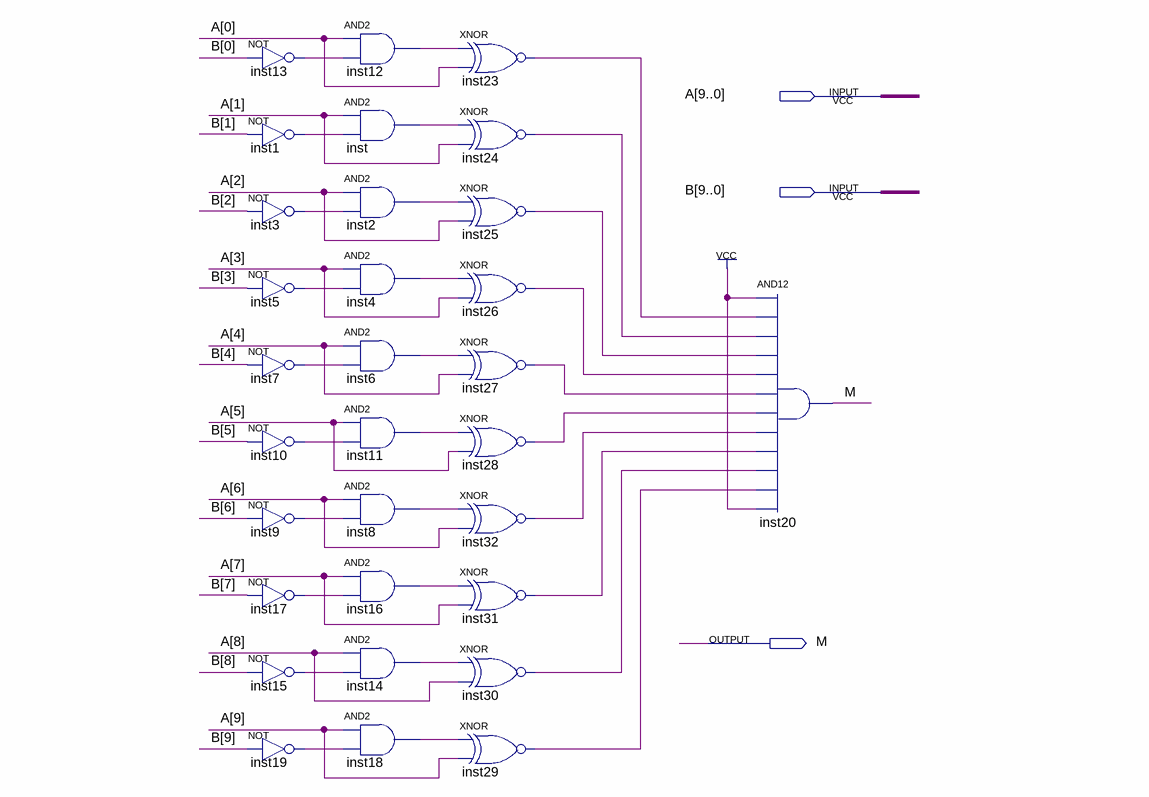
[diagram p0: schematic sheet]
// Quartus schematic Maior_10b.bdf as structural Verilog: 31 symbols, 3 pins
module Maior_10b (
  input  [9:0] A,
  input  [9:0] B,
  output M
);

  wire inst1_out, inst2_out, inst3_out, inst4_out, inst5_out, inst6_out, inst7_out, inst8_out, inst9_out,
       inst10_out, inst11_out, inst12_out, inst13_out, inst14_out, inst15_out, inst16_out, inst17_out,
       inst18_out, inst19_out, inst24_out, inst28_out, inst30_out, inst_out;

  not inst13 (inst13_out, B[0]);
  not inst1 (inst1_out, B[1]);
  not inst3 (inst3_out, B[2]);
  not inst5 (inst5_out, B[3]);
  not inst7 (inst7_out, B[4]);
  not inst10 (inst10_out, B[5]);
  not inst9 (inst9_out, B[6]);
  not inst17 (inst17_out, B[7]);
  not inst15 (inst15_out, B[8]);
  not inst19 (inst19_out, B[9]);
  and inst12 (inst12_out, A[0], inst13_out);
  and inst (inst_out, A[1], inst1_out);
  and inst2 (inst2_out, A[2], inst3_out);
  and inst4 (inst4_out, A[3], inst5_out);
  and inst6 (inst6_out, A[4], inst7_out);
  and inst11 (inst11_out, A[5], inst10_out);
  and inst8 (inst8_out, A[6], inst9_out);
  and inst16 (inst16_out, A[7], inst17_out);
  and inst14 (inst14_out, A[8], inst15_out);
  and inst18 (inst18_out, A[9], inst19_out);
  xnor inst23 (inst12_out, inst12_out, A[0]);
  xnor inst24 (inst24_out, inst_out, A[1]);
  xnor inst25 (inst2_out, inst2_out, A[2]);
  xnor inst26 (inst4_out, inst4_out, A[3]);
  xnor inst27 (inst6_out, inst6_out, A[4]);
  xnor inst28 (inst28_out, inst11_out, A[5]);
  xnor inst32 (inst8_out, inst8_out, A[6]);
  xnor inst31 (inst16_out, inst16_out, A[7]);
  xnor inst30 (inst30_out, inst14_out, A[8]);
  xnor inst29 (inst18_out, inst18_out, A[9]);
  and inst20 (M, 1'b1, inst12_out, inst24_out, inst2_out, inst4_out, inst6_out, inst28_out, inst8_out, inst16_out, inst30_out, inst18_out, 1'b1);
endmodule
